# Altium schematic sheet AirCraft_V1.0.SchDoc
size 292 x 193 mm; Website: wiki-power.com
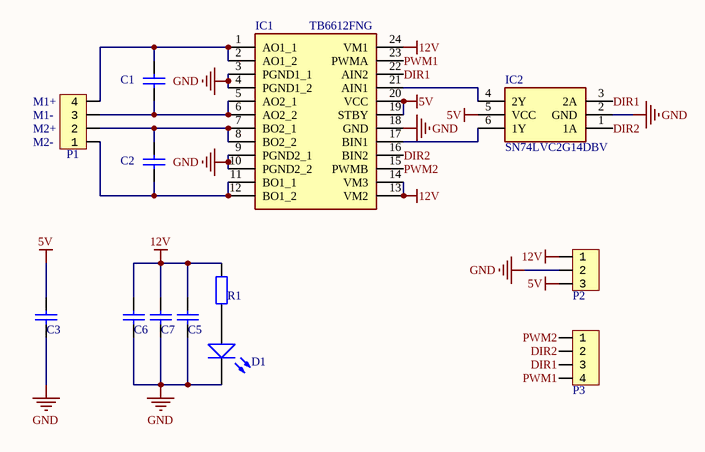
[diagram p0: AirCraft_V1.0.SchDoc]

## Parts
C1  100nF  [CAP-0603]  (value not drawn)
C2  100nF  [CAP-0603]  (value not drawn)
C3  100nF  [CAP-0603]  (value not drawn)
C5  100nF  [CAP-0603]  (value not drawn)
C6  47uF  [CAP-1206]  (value not drawn)
C7  47uF  [CAP-1206]  (value not drawn)
D1  RED  [LED-0603]  (value not drawn)
IC1  TB6612FNG  [SSOP24]
IC2  SN74LVC2G14DBV  [SOT-23-6]
P1  HDR1x4_2.54  [HDR1X4_2.54_90]  (value not drawn)
P2  XH-3AW  [XH_3]  (value not drawn)
P3  XH-4AW  [XH_4]  (value not drawn)
R1  4.7k  [R-0603]  (value not drawn)

## Nets
5V: C3.2 IC1.19(STBY) IC1.20(VCC) IC2.5(VCC) P2.3
12V: C5.2 C6.2 C7.2 IC1.13(VM2) IC1.14(VM3) IC1.24(VM1) P2.1 R1.2
GND: C3.1 C5.1 C6.1 C7.1 D1.K IC1.3(PGND1_1) IC1.4(PGND1_2) IC1.9(PGND2_1) IC1.10(PGND2_2) IC1.18(GND) IC2.2(GND) P2.2
DIR1: IC1.22(AIN2) IC2.3(2A) P3.3
DIR2: IC1.16(BIN2) IC2.1(1A) P3.2
PWM1: IC1.23(PWMA) P3.4
PWM2: IC1.15(PWMB) P3.1
NetC1_1: C1.1 IC1.5(AO2_1) IC1.6(AO2_2) P1.3
NetC1_2: C1.2 IC1.1(AO1_1) IC1.2(AO1_2) P1.4
NetC2_1: C2.1 IC1.11(BO1_1) IC1.12(BO1_2) P1.1
NetC2_2: C2.2 IC1.7(BO2_1) IC1.8(BO2_2) P1.2
NetD1_A: D1.A R1.1
NetIC1_17: IC1.17(BIN1) IC2.6(1Y)
NetIC1_21: IC1.21(AIN1) IC2.4(2Y)

## Notes on the sheet
- (near P1) M1+
- (near P1) M1-
- (near P1) M2+
- (near P1) M2-
- Author
- DocumentName
- ModifiedDate
- ProjectName
- SheetNumber
- SheetTotal
- Website
- Revision

## Library data of the parts
C1-C3 C5-C7 = CAP: 贴片电容; ComponentLink1Description: 供应商链接; ComponentLink1URL: http://www.szlcsc.com/product/details_53938.html; Package: 0402; Supplier: LC; SuppliersPartNumber: C52923
D1 = LED: 发光二极管; pin to pad: A>1 K>2; ComponentLink1Description: 供应商链接; ComponentLink1URL: http://www.szlcsc.com/product/details_2663.html; Package: 0603; Supplier: LC; SuppliersPartNumber: C2290
IC1 = TB6612FNG: 集成电机驱动芯片; Manufacturer_Name: Toshiba; Manufacturer_Part_Number: TB6612FNG(O,EL); Datasheet Link: https://th.mouser.com/datasheet/2/408/TB6612FNG_datasheet_en_20141001-708260.pdf; Height: 1.6mm; Mouser Part Number: 757-TB6612FNG(O,EL); Mouser Price/Stock: https://www.mouser.co.uk/ProductDetail/Toshiba/TB6612FNGOEL?qs=%2FbfygUuxYr5ys7QLPOzyng%3D%3D
IC2 = SN74LVC2G14DBV: 变换器; Manufacturer_Name: Texas Instruments; Manufacturer_Part_Number: SN74LVC2G14DBVR; Datasheet Link: http://componentsearchengine.com/Datasheets/3/SN74LVC2G14DBVR.pdf; Height: 1.45mm; Arrow Part Number: SN74LVC2G14DBVR; Arrow Price/Stock: https://www.arrow.com/en/products/sn74lvc2g14dbvr/texas-instruments; Mouser Part Number: 595-SN74LVC2G14DBVR; Mouser Price/Stock: https://www.mouser.co.uk/ProductDetail/Texas-Instruments/SN74LVC2G14DBVR?qs=q2XTDbzbm6DXbZiJ8Yzjpw%3D%3D
P1 P3 = HDR1x4_2.54: Header
P2 = HDR1x3_2.54: Header
R1 = RES: 贴片电阻; Package: 0805; Supplier: LC; SuppliersPartNumber: C17798